# Altium schematic sheet 2_Power.SchDoc: Title
size 420 x 297 mm; Address1: Address1; Address2: Address2; Address3: Address3; Address4: Address4; SheetNumber: 1; Scale: 1:1; Title2str: Title2str; DocumentType: Схема электрическая принципиальная
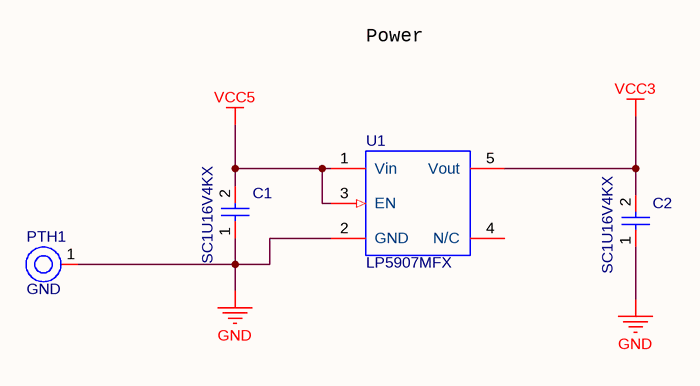
[diagram p0: 2_Power.SchDoc]

## Parts
C1  SC1U16V4KX  [CAPC0805(2012)145_L]
C2  SC1U16V4KX  [CAPC0805(2012)145_L]
PTH1  GND  [POWERHOLE-LP]  (no BOM)
U1  LP5907MFX  [SOT95P280X145-5L]

## Nets
GND: C1.1 C2.1 PTH1.1(H1) U1.2(GND)
VCC3: C2.2 U1.5(Vout)
VCC5: C1.2 U1.1(Vin) U1.3(EN)

Not connected (* = marked no-connect by the designer): U1 4(N/C)

## Notes on the sheet
- Power
- Перв. примен.
- Справ. №
- Подп. и дата
- Инв. № дубл.
- Взам. инв. №
- Разраб.
- Изм.
- Лист
- № докум.
- Подп.
- Дата
- Лит.
- Масса
- Масштаб
- Пров.
- Т.контр.
- Листов
- Инв. № подл.
- Утв.
- Н.контр.
- 2.106-A3
- Копировал
- Формат А3

## Library data of the parts
C1 C2 = CAP(0805)1UF16V: CAP 1uF 16V ±10% 0805(1610 Metric) Thickness 0.6mm SMD
PTH1 = PTH-1D2M: 1.2mm hole 2mm pad; Pad diameter (mm): 5; Hole diameter (mm): 2.5
U1 = LP5907V3.3: 3.3V 250mA